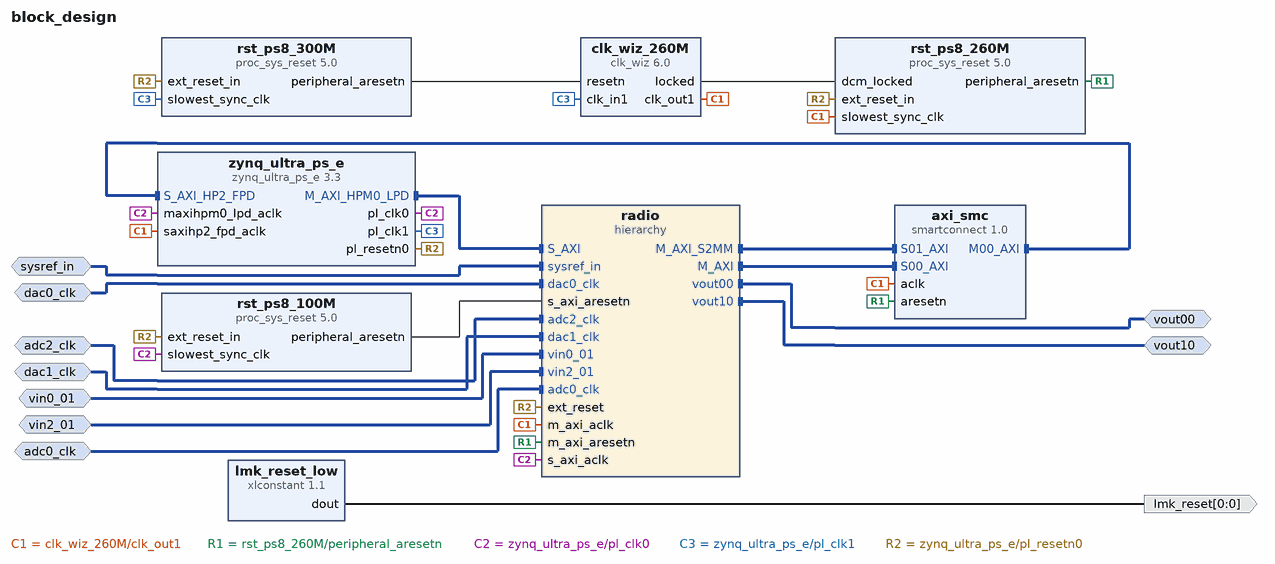
[diagram p0: block diagram of the top level]
# Vivado block design block_design, xczu28dr-ffvg1517-2-e, Vivado 2020.1
create_bd_design block_design

create_bd_intf_port -mode Slave -vlnv xilinx.com:interface:diff_clock_rtl:1.0 adc0_clk
set_property -dict {CONFIG.FREQ_HZ 409600000.0} [get_bd_intf_ports adc0_clk]
create_bd_intf_port -mode Slave -vlnv xilinx.com:interface:diff_clock_rtl:1.0 adc2_clk
set_property -dict {CONFIG.FREQ_HZ 409600000.0} [get_bd_intf_ports adc2_clk]
create_bd_intf_port -mode Slave -vlnv xilinx.com:interface:diff_clock_rtl:1.0 dac0_clk
set_property -dict {CONFIG.FREQ_HZ 256000000.0} [get_bd_intf_ports dac0_clk]
create_bd_intf_port -mode Slave -vlnv xilinx.com:interface:diff_clock_rtl:1.0 dac1_clk
set_property -dict {CONFIG.FREQ_HZ 409600000.0} [get_bd_intf_ports dac1_clk]
create_bd_intf_port -mode Slave -vlnv xilinx.com:display_usp_rf_data_converter:diff_pins_rtl:1.0 sysref_in
create_bd_intf_port -mode Slave -vlnv xilinx.com:interface:diff_analog_io_rtl:1.0 vin0_01
create_bd_intf_port -mode Slave -vlnv xilinx.com:interface:diff_analog_io_rtl:1.0 vin2_01
create_bd_intf_port -mode Master -vlnv xilinx.com:interface:diff_analog_io_rtl:1.0 vout00
create_bd_intf_port -mode Master -vlnv xilinx.com:interface:diff_analog_io_rtl:1.0 vout10
create_bd_port -dir O -from 0 -to 0 lmk_reset

create_bd_cell -type ip -vlnv xilinx.com:ip:smartconnect:1.0 axi_smc
set_property -dict {CONFIG.NUM_SI 2} [get_bd_cells axi_smc]
create_bd_cell -type ip -vlnv xilinx.com:ip:clk_wiz:6.0 clk_wiz_260M
set_property -dict [list \
  CONFIG.CLKOUT1_JITTER 173.009 \
  CONFIG.CLKOUT1_PHASE_ERROR 308.262 \
  CONFIG.CLKOUT1_REQUESTED_OUT_FREQ 259.99740 \
  CONFIG.MMCM_CLKFBOUT_MULT_F 60.125 \
  CONFIG.MMCM_CLKOUT0_DIVIDE_F 4.625 \
  CONFIG.MMCM_DIVCLK_DIVIDE 15 \
  CONFIG.RESET_PORT resetn \
  CONFIG.RESET_TYPE ACTIVE_LOW \
] [get_bd_cells clk_wiz_260M]
create_bd_cell -type ip -vlnv xilinx.com:ip:xlconstant:1.1 lmk_reset_low
set_property -dict {CONFIG.CONST_VAL 0} [get_bd_cells lmk_reset_low]
create_bd_cell -type hier radio
create_bd_cell -type ip -vlnv xilinx.com:ip:proc_sys_reset:5.0 rst_ps8_100M
create_bd_cell -type ip -vlnv xilinx.com:ip:proc_sys_reset:5.0 rst_ps8_260M
create_bd_cell -type ip -vlnv xilinx.com:ip:proc_sys_reset:5.0 rst_ps8_300M
create_bd_cell -type ip -vlnv xilinx.com:ip:zynq_ultra_ps_e:3.3 zynq_ultra_ps_e
set_property -dict [list \
  CONFIG.PSU__CRL_APB__PL0_REF_CTRL__SRCSEL IOPLL \
  CONFIG.PSU__CRL_APB__PL1_REF_CTRL__FREQMHZ 300 \
  CONFIG.PSU__CRL_APB__PL1_REF_CTRL__SRCSEL IOPLL \
  CONFIG.PSU__DDR_HIGH_ADDRESS_GUI_ENABLE 0 \
  CONFIG.PSU__FPGA_PL1_ENABLE 1 \
  CONFIG.PSU__USE__S_AXI_GP4 1 \
] [get_bd_cells zynq_ultra_ps_e]
# 28 more settings of zynq_ultra_ps_e are not shown: defaults, MIO pin electricals, DDR timing, and values the tool derives

# ---- hierarchy /radio ----
current_bd_instance /radio
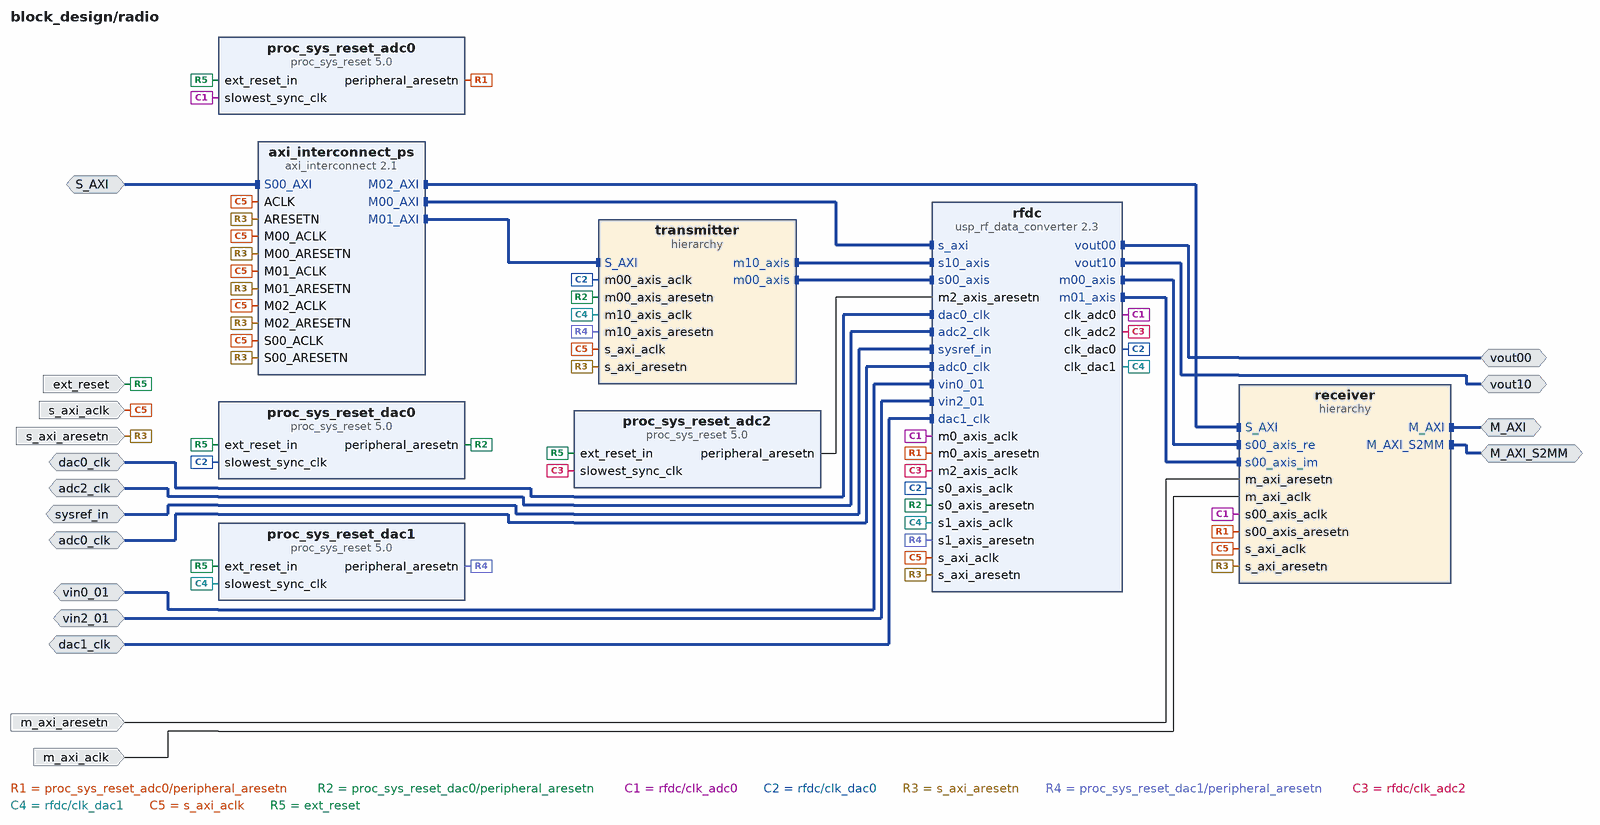
[diagram p1: block diagram inside /radio]
create_bd_intf_pin -mode Master -vlnv xilinx.com:interface:aximm_rtl:1.0 M_AXI
create_bd_intf_pin -mode Slave -vlnv xilinx.com:interface:aximm_rtl:1.0 S_AXI
create_bd_intf_pin -mode Slave -vlnv xilinx.com:interface:diff_clock_rtl:1.0 adc0_clk
create_bd_intf_pin -mode Slave -vlnv xilinx.com:interface:diff_clock_rtl:1.0 adc2_clk
create_bd_intf_pin -mode Slave -vlnv xilinx.com:interface:diff_clock_rtl:1.0 dac0_clk
create_bd_intf_pin -mode Slave -vlnv xilinx.com:interface:diff_clock_rtl:1.0 dac1_clk
create_bd_intf_pin -mode Slave -vlnv xilinx.com:display_usp_rf_data_converter:diff_pins_rtl:1.0 sysref_in
create_bd_intf_pin -mode Slave -vlnv xilinx.com:interface:diff_analog_io_rtl:1.0 vin0_01
create_bd_intf_pin -mode Slave -vlnv xilinx.com:interface:diff_analog_io_rtl:1.0 vin2_01
create_bd_intf_pin -mode Master -vlnv xilinx.com:interface:diff_analog_io_rtl:1.0 vout00
create_bd_intf_pin -mode Master -vlnv xilinx.com:interface:diff_analog_io_rtl:1.0 vout10
create_bd_intf_pin -mode Master -vlnv xilinx.com:interface:aximm_rtl:1.0 M_AXI_S2MM
create_bd_pin -dir I -type rst ext_reset
create_bd_pin -dir I -type clk m_axi_aclk
create_bd_pin -dir I -type rst m_axi_aresetn
create_bd_pin -dir I -type clk s_axi_aclk
create_bd_pin -dir I -type rst s_axi_aresetn

create_bd_cell -type ip -vlnv xilinx.com:ip:axi_interconnect:2.1 axi_interconnect_ps
set_property -dict {CONFIG.NUM_MI 3} [get_bd_cells axi_interconnect_ps]
create_bd_cell -type ip -vlnv xilinx.com:ip:proc_sys_reset:5.0 proc_sys_reset_adc0
create_bd_cell -type ip -vlnv xilinx.com:ip:proc_sys_reset:5.0 proc_sys_reset_adc2
create_bd_cell -type ip -vlnv xilinx.com:ip:proc_sys_reset:5.0 proc_sys_reset_dac0
create_bd_cell -type ip -vlnv xilinx.com:ip:proc_sys_reset:5.0 proc_sys_reset_dac1
create_bd_cell -type hier receiver
create_bd_cell -type ip -vlnv xilinx.com:ip:usp_rf_data_converter:2.3 rfdc
set_property -dict [list \
  CONFIG.ADC0_Outclk_Freq 153.600 \
  CONFIG.ADC0_PLL_Enable true \
  CONFIG.ADC0_Refclk_Freq 409.600 \
  CONFIG.ADC0_Sampling_Rate 2.4576 \
  CONFIG.ADC2_Outclk_Freq 256.000 \
  CONFIG.ADC2_PLL_Enable true \
  CONFIG.ADC2_Refclk_Freq 409.600 \
  CONFIG.ADC2_Sampling_Rate 4.096 \
  CONFIG.ADC_Data_Type00 1 \
  CONFIG.ADC_Data_Type20 1 \
  CONFIG.ADC_Data_Width00 8 \
  CONFIG.ADC_Decimation_Mode00 2 \
  CONFIG.ADC_Decimation_Mode20 2 \
  CONFIG.ADC_Mixer_Mode00 0 \
  CONFIG.ADC_Mixer_Mode20 0 \
  CONFIG.ADC_Mixer_Type00 2 \
  CONFIG.ADC_Mixer_Type01 2 \
  CONFIG.ADC_Mixer_Type20 2 \
  CONFIG.ADC_Mixer_Type21 2 \
  CONFIG.ADC_Slice00_Enable true \
  CONFIG.ADC_Slice20_Enable true \
  CONFIG.DAC0_Outclk_Freq 256.000 \
  CONFIG.DAC0_PLL_Enable true \
  CONFIG.DAC0_Refclk_Freq 256.000 \
  CONFIG.DAC0_Sampling_Rate 4.096 \
  CONFIG.DAC1_Outclk_Freq 256.000 \
  CONFIG.DAC1_PLL_Enable true \
  CONFIG.DAC1_Refclk_Freq 409.600 \
  CONFIG.DAC1_Sampling_Rate 4.096 \
  CONFIG.DAC_Data_Type10 0 \
  CONFIG.DAC_Data_Width10 16 \
  CONFIG.DAC_Interpolation_Mode00 2 \
  CONFIG.DAC_Interpolation_Mode10 2 \
  CONFIG.DAC_Mixer_Mode00 0 \
  CONFIG.DAC_Mixer_Mode10 0 \
  CONFIG.DAC_Mixer_Type00 2 \
  CONFIG.DAC_Mixer_Type10 2 \
  CONFIG.DAC_Slice00_Enable true \
  CONFIG.DAC_Slice10_Enable true \
] [get_bd_cells rfdc]
create_bd_cell -type hier transmitter

# ---- hierarchy /radio/receiver ----
current_bd_instance /radio/receiver
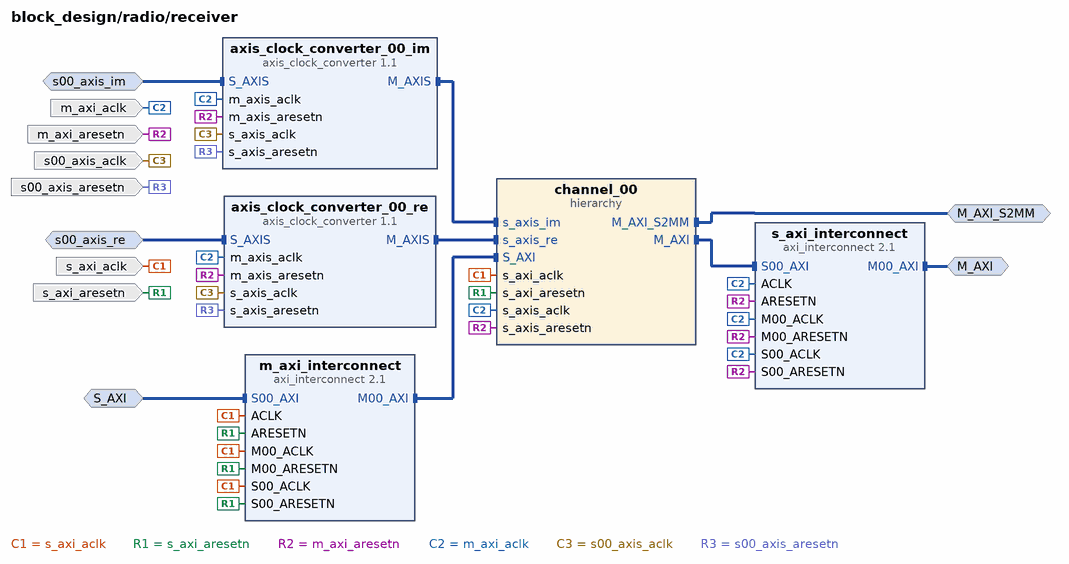
[diagram p2: block diagram inside /radio/receiver]
create_bd_intf_pin -mode Master -vlnv xilinx.com:interface:aximm_rtl:1.0 M_AXI
create_bd_intf_pin -mode Slave -vlnv xilinx.com:interface:aximm_rtl:1.0 S_AXI
create_bd_intf_pin -mode Slave -vlnv xilinx.com:interface:axis_rtl:1.0 s00_axis_im
create_bd_intf_pin -mode Slave -vlnv xilinx.com:interface:axis_rtl:1.0 s00_axis_re
create_bd_intf_pin -mode Master -vlnv xilinx.com:interface:aximm_rtl:1.0 M_AXI_S2MM
create_bd_pin -dir I -type clk m_axi_aclk
create_bd_pin -dir I -type rst m_axi_aresetn
create_bd_pin -dir I -type clk s00_axis_aclk
create_bd_pin -dir I -type rst s00_axis_aresetn
create_bd_pin -dir I -type clk s_axi_aclk
create_bd_pin -dir I -type rst s_axi_aresetn

create_bd_cell -type ip -vlnv xilinx.com:ip:axis_clock_converter:1.1 axis_clock_converter_00_im
set_property -dict {CONFIG.SYNCHRONIZATION_STAGES 5} [get_bd_cells axis_clock_converter_00_im]
create_bd_cell -type ip -vlnv xilinx.com:ip:axis_clock_converter:1.1 axis_clock_converter_00_re
set_property -dict {CONFIG.SYNCHRONIZATION_STAGES 5} [get_bd_cells axis_clock_converter_00_re]
create_bd_cell -type hier channel_00
create_bd_cell -type ip -vlnv xilinx.com:ip:axi_interconnect:2.1 m_axi_interconnect
set_property -dict {CONFIG.NUM_MI 1} [get_bd_cells m_axi_interconnect]
create_bd_cell -type ip -vlnv xilinx.com:ip:axi_interconnect:2.1 s_axi_interconnect
set_property -dict [list \
  CONFIG.M00_HAS_DATA_FIFO 2 \
  CONFIG.NUM_MI 1 \
  CONFIG.NUM_SI 1 \
  CONFIG.S00_HAS_DATA_FIFO 2 \
  CONFIG.S01_HAS_DATA_FIFO 2 \
  CONFIG.STRATEGY 0 \
] [get_bd_cells s_axi_interconnect]

# ---- hierarchy /radio/receiver/channel_00 ----
current_bd_instance /radio/receiver/channel_00
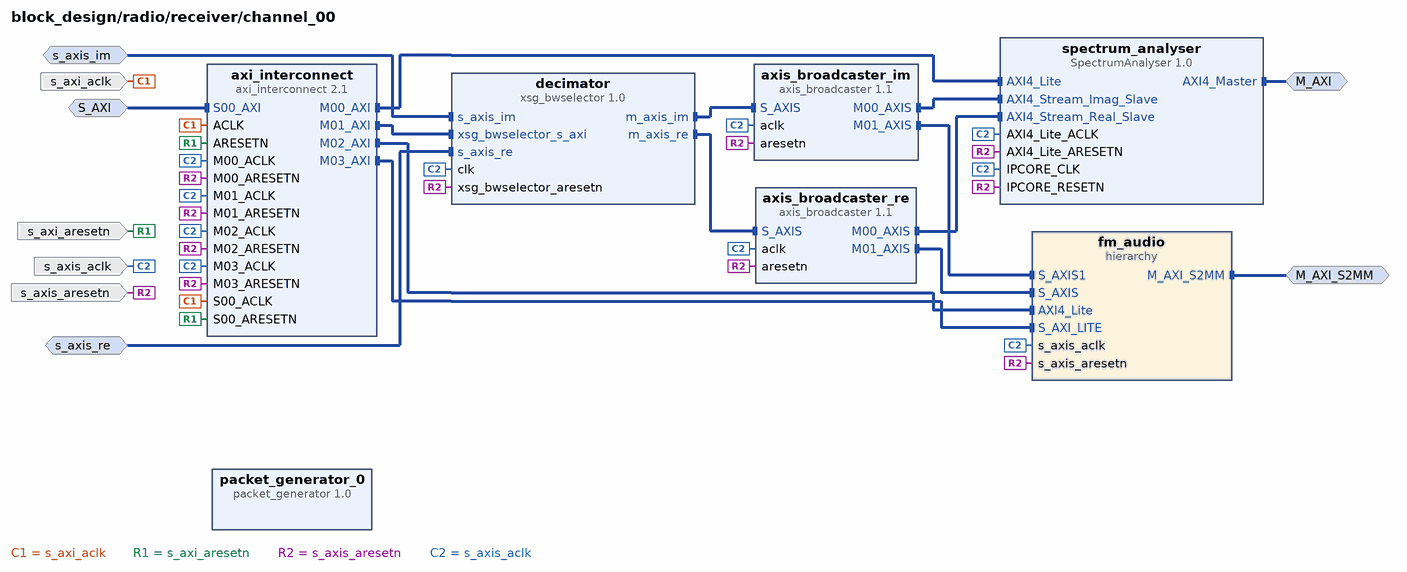
[diagram p3: block diagram inside /radio/receiver/channel_00]
create_bd_intf_pin -mode Master -vlnv xilinx.com:interface:aximm_rtl:1.0 M_AXI
create_bd_intf_pin -mode Slave -vlnv xilinx.com:interface:aximm_rtl:1.0 S_AXI
create_bd_intf_pin -mode Slave -vlnv xilinx.com:interface:axis_rtl:1.0 s_axis_im
create_bd_intf_pin -mode Slave -vlnv xilinx.com:interface:axis_rtl:1.0 s_axis_re
create_bd_intf_pin -mode Master -vlnv xilinx.com:interface:aximm_rtl:1.0 M_AXI_S2MM
create_bd_pin -dir I -type clk s_axi_aclk
create_bd_pin -dir I -type rst s_axi_aresetn
create_bd_pin -dir I -type clk s_axis_aclk
create_bd_pin -dir I -type rst s_axis_aresetn

create_bd_cell -type ip -vlnv xilinx.com:ip:axi_interconnect:2.1 axi_interconnect
set_property -dict {CONFIG.NUM_MI 4} [get_bd_cells axi_interconnect]
create_bd_cell -type ip -vlnv User_Company:RFSoC:xsg_bwselector:1.0 decimator
create_bd_cell -type ip -vlnv xilinx.com:ip:SpectrumAnalyser:1.0 spectrum_analyser
create_bd_cell -type ip -vlnv xilinx.com:ip:axis_broadcaster:1.1 axis_broadcaster_im
create_bd_cell -type ip -vlnv xilinx.com:ip:axis_broadcaster:1.1 axis_broadcaster_re
create_bd_cell -type hier fm_audio
create_bd_cell -type ip -vlnv xilinx.com:ip:packet_generator:1.0 packet_generator_0

# ---- hierarchy /radio/receiver/channel_00/fm_audio ----
current_bd_instance /radio/receiver/channel_00/fm_audio
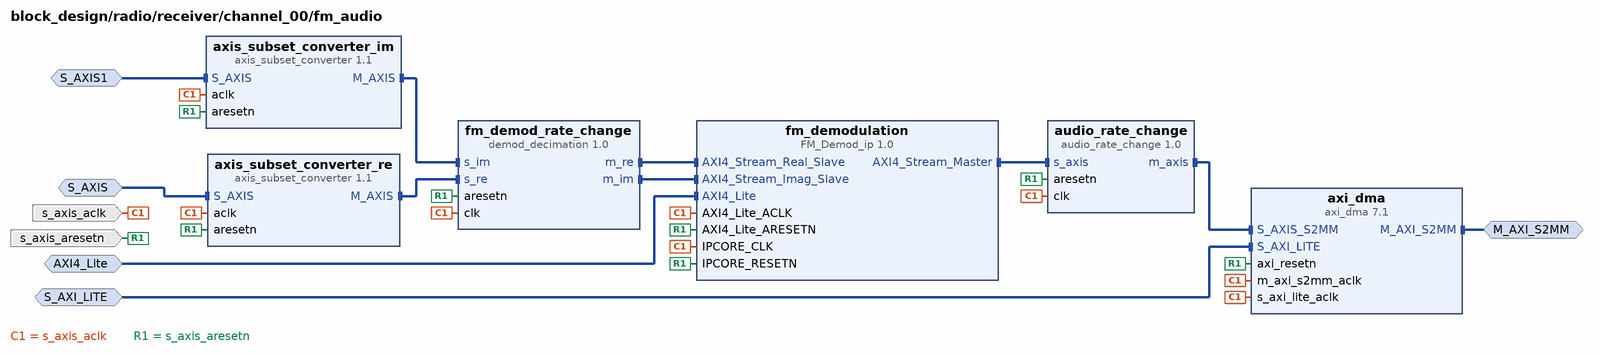
[diagram p4: block diagram inside /radio/receiver/channel_00/fm_audio]
create_bd_intf_pin -mode Slave -vlnv xilinx.com:interface:axis_rtl:1.0 S_AXIS
create_bd_intf_pin -mode Slave -vlnv xilinx.com:interface:axis_rtl:1.0 S_AXIS1
create_bd_intf_pin -mode Slave -vlnv xilinx.com:interface:aximm_rtl:1.0 AXI4_Lite
create_bd_intf_pin -mode Slave -vlnv xilinx.com:interface:aximm_rtl:1.0 S_AXI_LITE
create_bd_intf_pin -mode Master -vlnv xilinx.com:interface:aximm_rtl:1.0 M_AXI_S2MM
create_bd_pin -dir I -type clk s_axis_aclk
create_bd_pin -dir I -type rst s_axis_aresetn

create_bd_cell -type ip -vlnv xilinx.com:ip:axis_subset_converter:1.1 axis_subset_converter_re
set_property -dict [list \
  CONFIG.M_TDATA_NUM_BYTES 2 \
  CONFIG.S_TDATA_NUM_BYTES 16 \
  CONFIG.TDATA_REMAP {tdata[15:0]} \
] [get_bd_cells axis_subset_converter_re]
create_bd_cell -type ip -vlnv User_Company:SysGen:demod_decimation:1.0 fm_demod_rate_change
create_bd_cell -type ip -vlnv xilinx.com:ip:axis_subset_converter:1.1 axis_subset_converter_im
set_property -dict [list \
  CONFIG.M_TDATA_NUM_BYTES 2 \
  CONFIG.S_TDATA_NUM_BYTES 16 \
  CONFIG.TDATA_REMAP {tdata[15:0]} \
] [get_bd_cells axis_subset_converter_im]
create_bd_cell -type ip -vlnv User_Company:SysGen:audio_rate_change:1.0 audio_rate_change
create_bd_cell -type ip -vlnv ac.uk:ip:FM_Demod_ip:1.0 fm_demodulation
create_bd_cell -type ip -vlnv xilinx.com:ip:axi_dma:7.1 axi_dma
set_property -dict [list \
  CONFIG.c_addr_width 64 \
  CONFIG.c_include_mm2s 0 \
  CONFIG.c_include_sg 0 \
  CONFIG.c_s2mm_burst_size 256 \
] [get_bd_cells axi_dma]

# ---- hierarchy /radio/transmitter ----
current_bd_instance /radio/transmitter
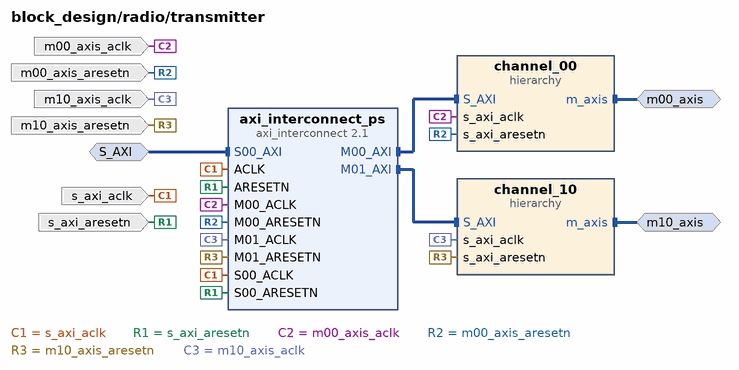
[diagram p5: block diagram inside /radio/transmitter]
create_bd_intf_pin -mode Slave -vlnv xilinx.com:interface:aximm_rtl:1.0 S_AXI
create_bd_intf_pin -mode Master -vlnv xilinx.com:interface:axis_rtl:1.0 m00_axis
create_bd_intf_pin -mode Master -vlnv xilinx.com:interface:axis_rtl:1.0 m10_axis
create_bd_pin -dir I -type clk m00_axis_aclk
create_bd_pin -dir I -type rst m00_axis_aresetn
create_bd_pin -dir I -type clk m10_axis_aclk
create_bd_pin -dir I -type rst m10_axis_aresetn
create_bd_pin -dir I -type clk s_axi_aclk
create_bd_pin -dir I -type rst s_axi_aresetn

create_bd_cell -type ip -vlnv xilinx.com:ip:axi_interconnect:2.1 axi_interconnect_ps
create_bd_cell -type hier channel_00
create_bd_cell -type hier channel_10

# ---- hierarchy /radio/transmitter/channel_00 ----
current_bd_instance /radio/transmitter/channel_00
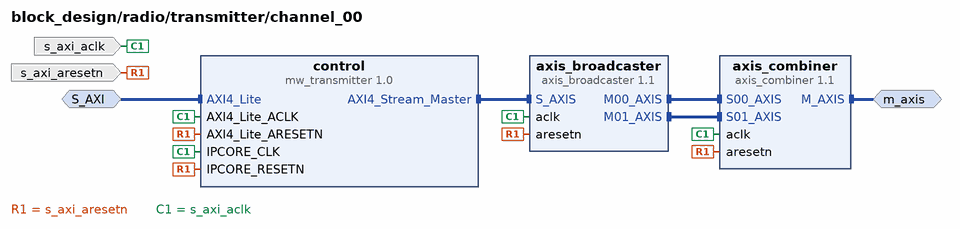
[diagram p6: block diagram inside /radio/transmitter/channel_00]
create_bd_intf_pin -mode Slave -vlnv xilinx.com:interface:aximm_rtl:1.0 S_AXI
create_bd_intf_pin -mode Master -vlnv xilinx.com:interface:axis_rtl:1.0 m_axis
create_bd_pin -dir I -type clk s_axi_aclk
create_bd_pin -dir I -type rst s_axi_aresetn

create_bd_cell -type ip -vlnv xilinx.com:ip:axis_broadcaster:1.1 axis_broadcaster
create_bd_cell -type ip -vlnv xilinx.com:ip:axis_combiner:1.1 axis_combiner
create_bd_cell -type ip -vlnv xilinx.com:ip:mw_transmitter:1.0 control

# ---- hierarchy /radio/transmitter/channel_10 ----
current_bd_instance /radio/transmitter/channel_10
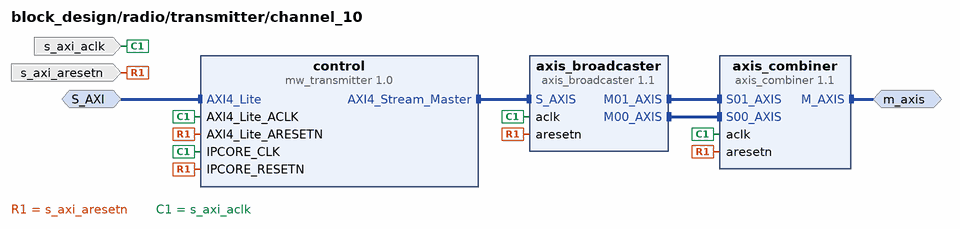
[diagram p7: block diagram inside /radio/transmitter/channel_10]
create_bd_intf_pin -mode Slave -vlnv xilinx.com:interface:aximm_rtl:1.0 S_AXI
create_bd_intf_pin -mode Master -vlnv xilinx.com:interface:axis_rtl:1.0 m_axis
create_bd_pin -dir I -type clk s_axi_aclk
create_bd_pin -dir I -type rst s_axi_aresetn

create_bd_cell -type ip -vlnv xilinx.com:ip:axis_broadcaster:1.1 axis_broadcaster
create_bd_cell -type ip -vlnv xilinx.com:ip:axis_combiner:1.1 axis_combiner
create_bd_cell -type ip -vlnv xilinx.com:ip:mw_transmitter:1.0 control

# ---- connections ----

current_bd_instance /radio
connect_bd_intf_net [get_bd_intf_pins M_AXI] [get_bd_intf_pins receiver/M_AXI]
connect_bd_intf_net [get_bd_intf_pins receiver/s00_axis_re] [get_bd_intf_pins rfdc/m00_axis]
connect_bd_intf_net [get_bd_intf_pins rfdc/s10_axis] [get_bd_intf_pins transmitter/m10_axis]
connect_bd_intf_net [get_bd_intf_pins vout10] [get_bd_intf_pins rfdc/vout10]
connect_bd_intf_net [get_bd_intf_pins receiver/s00_axis_im] [get_bd_intf_pins rfdc/m01_axis]
connect_bd_intf_net [get_bd_intf_pins dac0_clk] [get_bd_intf_pins rfdc/dac0_clk]
connect_bd_intf_net [get_bd_intf_pins adc2_clk] [get_bd_intf_pins rfdc/adc2_clk]
connect_bd_intf_net [get_bd_intf_pins S_AXI] [get_bd_intf_pins axi_interconnect_ps/S00_AXI]
connect_bd_intf_net [get_bd_intf_pins vout00] [get_bd_intf_pins rfdc/vout00]
connect_bd_intf_net [get_bd_intf_pins axi_interconnect_ps/M02_AXI] [get_bd_intf_pins receiver/S_AXI]
connect_bd_intf_net [get_bd_intf_pins axi_interconnect_ps/M01_AXI] [get_bd_intf_pins transmitter/S_AXI]
connect_bd_intf_net [get_bd_intf_pins sysref_in] [get_bd_intf_pins rfdc/sysref_in]
connect_bd_intf_net [get_bd_intf_pins rfdc/s00_axis] [get_bd_intf_pins transmitter/m00_axis]
connect_bd_intf_net [get_bd_intf_pins adc0_clk] [get_bd_intf_pins rfdc/adc0_clk]
connect_bd_intf_net [get_bd_intf_pins M_AXI_S2MM] [get_bd_intf_pins receiver/M_AXI_S2MM]
connect_bd_intf_net [get_bd_intf_pins vin0_01] [get_bd_intf_pins rfdc/vin0_01]
connect_bd_intf_net [get_bd_intf_pins axi_interconnect_ps/M00_AXI] [get_bd_intf_pins rfdc/s_axi]
connect_bd_intf_net [get_bd_intf_pins vin2_01] [get_bd_intf_pins rfdc/vin2_01]
connect_bd_intf_net [get_bd_intf_pins dac1_clk] [get_bd_intf_pins rfdc/dac1_clk]
connect_bd_net -net IPCORE_RESETN_0_1 [get_bd_pins m_axi_aresetn] [get_bd_pins receiver/m_axi_aresetn]
connect_bd_net -net m_axis_aclk_0_1 [get_bd_pins m_axi_aclk] [get_bd_pins receiver/m_axi_aclk]
connect_bd_net -net proc_sys_reset_adc3_peripheral_aresetn [get_bd_pins proc_sys_reset_adc0/peripheral_aresetn] \
  [get_bd_pins receiver/s00_axis_aresetn] [get_bd_pins rfdc/m0_axis_aresetn]
connect_bd_net [get_bd_pins proc_sys_reset_dac0/peripheral_aresetn] [get_bd_pins rfdc/s0_axis_aresetn] [get_bd_pins transmitter/m00_axis_aresetn]
connect_bd_net -net proc_sys_reset_peripheral_aresetn [get_bd_pins proc_sys_reset_adc2/peripheral_aresetn] [get_bd_pins rfdc/m2_axis_aresetn]
connect_bd_net [get_bd_pins rfdc/clk_adc0] \
  [get_bd_pins proc_sys_reset_adc0/slowest_sync_clk] [get_bd_pins receiver/s00_axis_aclk] [get_bd_pins rfdc/m0_axis_aclk]
connect_bd_net [get_bd_pins rfdc/clk_dac0] \
  [get_bd_pins proc_sys_reset_dac0/slowest_sync_clk] [get_bd_pins rfdc/s0_axis_aclk] [get_bd_pins transmitter/m00_axis_aclk]
connect_bd_net -net rst_ps8_96M_peripheral_aresetn [get_bd_pins s_axi_aresetn] \
  [get_bd_pins axi_interconnect_ps/ARESETN] [get_bd_pins axi_interconnect_ps/M00_ARESETN] \
  [get_bd_pins axi_interconnect_ps/M01_ARESETN] [get_bd_pins axi_interconnect_ps/M02_ARESETN] \
  [get_bd_pins axi_interconnect_ps/S00_ARESETN] [get_bd_pins receiver/s_axi_aresetn] [get_bd_pins rfdc/s_axi_aresetn] \
  [get_bd_pins transmitter/s_axi_aresetn]
connect_bd_net -net rst_usp_rf_data_converter_256M_peripheral_aresetn [get_bd_pins proc_sys_reset_dac1/peripheral_aresetn] \
  [get_bd_pins rfdc/s1_axis_aresetn] [get_bd_pins transmitter/m10_axis_aresetn]
connect_bd_net -net usp_rf_data_converter_clk_adc2 [get_bd_pins rfdc/clk_adc2] \
  [get_bd_pins proc_sys_reset_adc2/slowest_sync_clk] [get_bd_pins rfdc/m2_axis_aclk]
connect_bd_net -net usp_rf_data_converter_clk_dac1 [get_bd_pins rfdc/clk_dac1] \
  [get_bd_pins proc_sys_reset_dac1/slowest_sync_clk] [get_bd_pins rfdc/s1_axis_aclk] [get_bd_pins transmitter/m10_axis_aclk]
connect_bd_net -net zynq_ultra_ps_e_pl_clk0 [get_bd_pins s_axi_aclk] \
  [get_bd_pins axi_interconnect_ps/ACLK] [get_bd_pins axi_interconnect_ps/M00_ACLK] \
  [get_bd_pins axi_interconnect_ps/M01_ACLK] [get_bd_pins axi_interconnect_ps/M02_ACLK] \
  [get_bd_pins axi_interconnect_ps/S00_ACLK] [get_bd_pins receiver/s_axi_aclk] [get_bd_pins rfdc/s_axi_aclk] \
  [get_bd_pins transmitter/s_axi_aclk]
connect_bd_net -net zynq_ultra_ps_e_pl_resetn0 [get_bd_pins ext_reset] \
  [get_bd_pins proc_sys_reset_adc0/ext_reset_in] [get_bd_pins proc_sys_reset_adc2/ext_reset_in] \
  [get_bd_pins proc_sys_reset_dac0/ext_reset_in] [get_bd_pins proc_sys_reset_dac1/ext_reset_in]

current_bd_instance /radio/receiver
connect_bd_intf_net [get_bd_intf_pins channel_00/S_AXI] [get_bd_intf_pins m_axi_interconnect/M00_AXI]
connect_bd_intf_net [get_bd_intf_pins s00_axis_re] [get_bd_intf_pins axis_clock_converter_00_re/S_AXIS]
connect_bd_intf_net [get_bd_intf_pins axis_clock_converter_00_im/M_AXIS] [get_bd_intf_pins channel_00/s_axis_im]
connect_bd_intf_net [get_bd_intf_pins M_AXI] [get_bd_intf_pins s_axi_interconnect/M00_AXI]
connect_bd_intf_net [get_bd_intf_pins S_AXI] [get_bd_intf_pins m_axi_interconnect/S00_AXI]
connect_bd_intf_net [get_bd_intf_pins channel_00/M_AXI] [get_bd_intf_pins s_axi_interconnect/S00_AXI]
connect_bd_intf_net [get_bd_intf_pins s00_axis_im] [get_bd_intf_pins axis_clock_converter_00_im/S_AXIS]
connect_bd_intf_net [get_bd_intf_pins axis_clock_converter_00_re/M_AXIS] [get_bd_intf_pins channel_00/s_axis_re]
connect_bd_intf_net [get_bd_intf_pins M_AXI_S2MM] [get_bd_intf_pins channel_00/M_AXI_S2MM]
connect_bd_net -net ACLK_1 [get_bd_pins s_axi_aclk] \
  [get_bd_pins channel_00/s_axi_aclk] [get_bd_pins m_axi_interconnect/ACLK] [get_bd_pins m_axi_interconnect/M00_ACLK] \
  [get_bd_pins m_axi_interconnect/S00_ACLK]
connect_bd_net -net ARESETN_1 [get_bd_pins s_axi_aresetn] \
  [get_bd_pins channel_00/s_axi_aresetn] [get_bd_pins m_axi_interconnect/ARESETN] \
  [get_bd_pins m_axi_interconnect/M00_ARESETN] [get_bd_pins m_axi_interconnect/S00_ARESETN]
connect_bd_net -net IPCORE_RESETN_0_1 [get_bd_pins m_axi_aresetn] \
  [get_bd_pins axis_clock_converter_00_im/m_axis_aresetn] [get_bd_pins axis_clock_converter_00_re/m_axis_aresetn] \
  [get_bd_pins channel_00/s_axis_aresetn] [get_bd_pins s_axi_interconnect/ARESETN] \
  [get_bd_pins s_axi_interconnect/M00_ARESETN] [get_bd_pins s_axi_interconnect/S00_ARESETN]
connect_bd_net -net m_axis_aclk_0_1 [get_bd_pins m_axi_aclk] \
  [get_bd_pins axis_clock_converter_00_im/m_axis_aclk] [get_bd_pins axis_clock_converter_00_re/m_axis_aclk] \
  [get_bd_pins channel_00/s_axis_aclk] [get_bd_pins s_axi_interconnect/ACLK] [get_bd_pins s_axi_interconnect/M00_ACLK] \
  [get_bd_pins s_axi_interconnect/S00_ACLK]
connect_bd_net -net s_axis_aclk_1 [get_bd_pins s00_axis_aclk] \
  [get_bd_pins axis_clock_converter_00_im/s_axis_aclk] [get_bd_pins axis_clock_converter_00_re/s_axis_aclk]
connect_bd_net -net s_axis_aresetn_1 [get_bd_pins s00_axis_aresetn] \
  [get_bd_pins axis_clock_converter_00_im/s_axis_aresetn] [get_bd_pins axis_clock_converter_00_re/s_axis_aresetn]

current_bd_instance /radio/receiver/channel_00
connect_bd_intf_net [get_bd_intf_pins S_AXI] [get_bd_intf_pins axi_interconnect/S00_AXI]
connect_bd_intf_net [get_bd_intf_pins axis_broadcaster_im/S_AXIS] [get_bd_intf_pins decimator/m_axis_im]
connect_bd_intf_net [get_bd_intf_pins axis_broadcaster_im/M01_AXIS] [get_bd_intf_pins fm_audio/S_AXIS1]
connect_bd_intf_net [get_bd_intf_pins axi_interconnect/M01_AXI] [get_bd_intf_pins decimator/xsg_bwselector_s_axi]
connect_bd_intf_net [get_bd_intf_pins s_axis_im] [get_bd_intf_pins decimator/s_axis_im]
connect_bd_intf_net [get_bd_intf_pins s_axis_re] [get_bd_intf_pins decimator/s_axis_re]
connect_bd_intf_net [get_bd_intf_pins axis_broadcaster_re/M00_AXIS] [get_bd_intf_pins spectrum_analyser/AXI4_Stream_Real_Slave]
connect_bd_intf_net [get_bd_intf_pins fm_audio/AXI4_Lite] [get_bd_intf_pins axi_interconnect/M02_AXI]
connect_bd_intf_net [get_bd_intf_pins axi_interconnect/M03_AXI] [get_bd_intf_pins fm_audio/S_AXI_LITE]
connect_bd_intf_net [get_bd_intf_pins axis_broadcaster_im/M00_AXIS] [get_bd_intf_pins spectrum_analyser/AXI4_Stream_Imag_Slave]
connect_bd_intf_net [get_bd_intf_pins M_AXI] [get_bd_intf_pins spectrum_analyser/AXI4_Master]
connect_bd_intf_net [get_bd_intf_pins axi_interconnect/M00_AXI] [get_bd_intf_pins spectrum_analyser/AXI4_Lite]
connect_bd_intf_net [get_bd_intf_pins axis_broadcaster_re/M01_AXIS] [get_bd_intf_pins fm_audio/S_AXIS]
connect_bd_intf_net [get_bd_intf_pins M_AXI_S2MM] [get_bd_intf_pins fm_audio/M_AXI_S2MM]
connect_bd_intf_net [get_bd_intf_pins axis_broadcaster_re/S_AXIS] [get_bd_intf_pins decimator/m_axis_re]
connect_bd_net -net ACLK_1 [get_bd_pins s_axi_aclk] [get_bd_pins axi_interconnect/ACLK] [get_bd_pins axi_interconnect/S00_ACLK]
connect_bd_net -net ARESETN_1 [get_bd_pins s_axi_aresetn] [get_bd_pins axi_interconnect/ARESETN] [get_bd_pins axi_interconnect/S00_ARESETN]
connect_bd_net -net proc_sys_reset_peripheral_aresetn [get_bd_pins s_axis_aresetn] \
  [get_bd_pins axi_interconnect/M00_ARESETN] [get_bd_pins axi_interconnect/M01_ARESETN] \
  [get_bd_pins decimator/xsg_bwselector_aresetn] [get_bd_pins spectrum_analyser/AXI4_Lite_ARESETN] \
  [get_bd_pins spectrum_analyser/IPCORE_RESETN] [get_bd_pins axis_broadcaster_re/aresetn] \
  [get_bd_pins axis_broadcaster_im/aresetn] [get_bd_pins axi_interconnect/M02_ARESETN] \
  [get_bd_pins axi_interconnect/M03_ARESETN] [get_bd_pins fm_audio/s_axis_aresetn]
connect_bd_net -net usp_rf_data_converter_clk_adc2 [get_bd_pins s_axis_aclk] \
  [get_bd_pins axi_interconnect/M00_ACLK] [get_bd_pins axi_interconnect/M01_ACLK] [get_bd_pins decimator/clk] \
  [get_bd_pins spectrum_analyser/AXI4_Lite_ACLK] [get_bd_pins spectrum_analyser/IPCORE_CLK] \
  [get_bd_pins axis_broadcaster_re/aclk] [get_bd_pins axis_broadcaster_im/aclk] [get_bd_pins axi_interconnect/M02_ACLK] \
  [get_bd_pins axi_interconnect/M03_ACLK] [get_bd_pins fm_audio/s_axis_aclk]

current_bd_instance /radio/receiver/channel_00/fm_audio
connect_bd_intf_net [get_bd_intf_pins fm_demod_rate_change/m_re] [get_bd_intf_pins fm_demodulation/AXI4_Stream_Real_Slave]
connect_bd_intf_net [get_bd_intf_pins S_AXIS1] [get_bd_intf_pins axis_subset_converter_im/S_AXIS]
connect_bd_intf_net [get_bd_intf_pins fm_demodulation/AXI4_Stream_Master] [get_bd_intf_pins audio_rate_change/s_axis]
connect_bd_intf_net [get_bd_intf_pins axis_subset_converter_re/M_AXIS] [get_bd_intf_pins fm_demod_rate_change/s_re]
connect_bd_intf_net [get_bd_intf_pins S_AXIS] [get_bd_intf_pins axis_subset_converter_re/S_AXIS]
connect_bd_intf_net [get_bd_intf_pins axis_subset_converter_im/M_AXIS] [get_bd_intf_pins fm_demod_rate_change/s_im]
connect_bd_intf_net [get_bd_intf_pins audio_rate_change/m_axis] [get_bd_intf_pins axi_dma/S_AXIS_S2MM]
connect_bd_intf_net [get_bd_intf_pins fm_demod_rate_change/m_im] [get_bd_intf_pins fm_demodulation/AXI4_Stream_Imag_Slave]
connect_bd_intf_net [get_bd_intf_pins S_AXI_LITE] [get_bd_intf_pins axi_dma/S_AXI_LITE]
connect_bd_intf_net [get_bd_intf_pins AXI4_Lite] [get_bd_intf_pins fm_demodulation/AXI4_Lite]
connect_bd_intf_net [get_bd_intf_pins M_AXI_S2MM] [get_bd_intf_pins axi_dma/M_AXI_S2MM]
connect_bd_net -net usp_rf_data_converter_clk_adc2 [get_bd_pins s_axis_aclk] \
  [get_bd_pins axi_dma/s_axi_lite_aclk] [get_bd_pins axi_dma/m_axi_s2mm_aclk] [get_bd_pins axis_subset_converter_im/aclk] \
  [get_bd_pins fm_demod_rate_change/clk] [get_bd_pins audio_rate_change/clk] [get_bd_pins fm_demodulation/IPCORE_CLK] \
  [get_bd_pins fm_demodulation/AXI4_Lite_ACLK] [get_bd_pins axis_subset_converter_re/aclk]
connect_bd_net -net proc_sys_reset_peripheral_aresetn [get_bd_pins s_axis_aresetn] \
  [get_bd_pins axi_dma/axi_resetn] [get_bd_pins axis_subset_converter_im/aresetn] [get_bd_pins fm_demod_rate_change/aresetn] \
  [get_bd_pins audio_rate_change/aresetn] [get_bd_pins fm_demodulation/IPCORE_RESETN] \
  [get_bd_pins fm_demodulation/AXI4_Lite_ARESETN] [get_bd_pins axis_subset_converter_re/aresetn]

current_bd_instance /radio/transmitter
connect_bd_intf_net [get_bd_intf_pins m10_axis] [get_bd_intf_pins channel_10/m_axis]
connect_bd_intf_net [get_bd_intf_pins m00_axis] [get_bd_intf_pins channel_00/m_axis]
connect_bd_intf_net [get_bd_intf_pins axi_interconnect_ps/M01_AXI] [get_bd_intf_pins channel_10/S_AXI]
connect_bd_intf_net [get_bd_intf_pins S_AXI] [get_bd_intf_pins axi_interconnect_ps/S00_AXI]
connect_bd_intf_net [get_bd_intf_pins axi_interconnect_ps/M00_AXI] [get_bd_intf_pins channel_00/S_AXI]
connect_bd_net -net ACLK_1 [get_bd_pins s_axi_aclk] [get_bd_pins axi_interconnect_ps/ACLK] [get_bd_pins axi_interconnect_ps/S00_ACLK]
connect_bd_net -net ARESETN_1 [get_bd_pins s_axi_aresetn] [get_bd_pins axi_interconnect_ps/ARESETN] [get_bd_pins axi_interconnect_ps/S00_ARESETN]
connect_bd_net -net M00_ACLK_1 [get_bd_pins m00_axis_aclk] [get_bd_pins axi_interconnect_ps/M00_ACLK] [get_bd_pins channel_00/s_axi_aclk]
connect_bd_net -net M00_ARESETN_1 [get_bd_pins m00_axis_aresetn] [get_bd_pins axi_interconnect_ps/M00_ARESETN] [get_bd_pins channel_00/s_axi_aresetn]
connect_bd_net -net rst_usp_rf_data_converter_256M_peripheral_aresetn [get_bd_pins m10_axis_aresetn] \
  [get_bd_pins axi_interconnect_ps/M01_ARESETN] [get_bd_pins channel_10/s_axi_aresetn]
connect_bd_net -net usp_rf_data_converter_clk_dac1 [get_bd_pins m10_axis_aclk] \
  [get_bd_pins axi_interconnect_ps/M01_ACLK] [get_bd_pins channel_10/s_axi_aclk]

current_bd_instance /radio/transmitter/channel_00
connect_bd_intf_net [get_bd_intf_pins axis_broadcaster/M00_AXIS] [get_bd_intf_pins axis_combiner/S00_AXIS]
connect_bd_intf_net [get_bd_intf_pins S_AXI] [get_bd_intf_pins control/AXI4_Lite]
connect_bd_intf_net [get_bd_intf_pins axis_broadcaster/S_AXIS] [get_bd_intf_pins control/AXI4_Stream_Master]
connect_bd_intf_net [get_bd_intf_pins m_axis] [get_bd_intf_pins axis_combiner/M_AXIS]
connect_bd_intf_net [get_bd_intf_pins axis_broadcaster/M01_AXIS] [get_bd_intf_pins axis_combiner/S01_AXIS]
connect_bd_net -net rst_usp_rf_data_converter_256M_peripheral_aresetn [get_bd_pins s_axi_aresetn] \
  [get_bd_pins axis_broadcaster/aresetn] [get_bd_pins axis_combiner/aresetn] [get_bd_pins control/AXI4_Lite_ARESETN] \
  [get_bd_pins control/IPCORE_RESETN]
connect_bd_net -net usp_rf_data_converter_clk_dac1 [get_bd_pins s_axi_aclk] \
  [get_bd_pins axis_broadcaster/aclk] [get_bd_pins axis_combiner/aclk] [get_bd_pins control/AXI4_Lite_ACLK] \
  [get_bd_pins control/IPCORE_CLK]

current_bd_instance /radio/transmitter/channel_10
connect_bd_intf_net [get_bd_intf_pins axis_broadcaster/M01_AXIS] [get_bd_intf_pins axis_combiner/S01_AXIS]
connect_bd_intf_net [get_bd_intf_pins axis_broadcaster/S_AXIS] [get_bd_intf_pins control/AXI4_Stream_Master]
connect_bd_intf_net [get_bd_intf_pins m_axis] [get_bd_intf_pins axis_combiner/M_AXIS]
connect_bd_intf_net [get_bd_intf_pins S_AXI] [get_bd_intf_pins control/AXI4_Lite]
connect_bd_intf_net [get_bd_intf_pins axis_broadcaster/M00_AXIS] [get_bd_intf_pins axis_combiner/S00_AXIS]
connect_bd_net -net rst_usp_rf_data_converter_256M_peripheral_aresetn [get_bd_pins s_axi_aresetn] \
  [get_bd_pins axis_broadcaster/aresetn] [get_bd_pins axis_combiner/aresetn] [get_bd_pins control/AXI4_Lite_ARESETN] \
  [get_bd_pins control/IPCORE_RESETN]
connect_bd_net -net usp_rf_data_converter_clk_dac1 [get_bd_pins s_axi_aclk] \
  [get_bd_pins axis_broadcaster/aclk] [get_bd_pins axis_combiner/aclk] [get_bd_pins control/AXI4_Lite_ACLK] \
  [get_bd_pins control/IPCORE_CLK]

current_bd_instance /
connect_bd_intf_net [get_bd_intf_ports sysref_in] [get_bd_intf_pins radio/sysref_in]
connect_bd_intf_net [get_bd_intf_ports vout00] [get_bd_intf_pins radio/vout00]
connect_bd_intf_net [get_bd_intf_ports dac0_clk] [get_bd_intf_pins radio/dac0_clk]
connect_bd_intf_net [get_bd_intf_ports adc2_clk] [get_bd_intf_pins radio/adc2_clk]
connect_bd_intf_net [get_bd_intf_ports vout10] [get_bd_intf_pins radio/vout10]
connect_bd_intf_net [get_bd_intf_pins axi_smc/S01_AXI] [get_bd_intf_pins radio/M_AXI_S2MM]
connect_bd_intf_net [get_bd_intf_ports dac1_clk] [get_bd_intf_pins radio/dac1_clk]
connect_bd_intf_net [get_bd_intf_pins radio/S_AXI] [get_bd_intf_pins zynq_ultra_ps_e/M_AXI_HPM0_LPD]
connect_bd_intf_net [get_bd_intf_ports vin0_01] [get_bd_intf_pins radio/vin0_01]
connect_bd_intf_net [get_bd_intf_ports vin2_01] [get_bd_intf_pins radio/vin2_01]
connect_bd_intf_net [get_bd_intf_pins axi_smc/M00_AXI] [get_bd_intf_pins zynq_ultra_ps_e/S_AXI_HP2_FPD]
connect_bd_intf_net [get_bd_intf_ports adc0_clk] [get_bd_intf_pins radio/adc0_clk]
connect_bd_intf_net [get_bd_intf_pins axi_smc/S00_AXI] [get_bd_intf_pins radio/M_AXI]
connect_bd_net [get_bd_pins clk_wiz_260M/clk_out1] \
  [get_bd_pins axi_smc/aclk] [get_bd_pins radio/m_axi_aclk] [get_bd_pins rst_ps8_260M/slowest_sync_clk] \
  [get_bd_pins zynq_ultra_ps_e/saxihp2_fpd_aclk]
connect_bd_net [get_bd_pins clk_wiz_260M/locked] [get_bd_pins rst_ps8_260M/dcm_locked]
connect_bd_net [get_bd_pins lmk_reset_low/dout] [get_bd_ports lmk_reset]
connect_bd_net [get_bd_pins rst_ps8_260M/peripheral_aresetn] [get_bd_pins axi_smc/aresetn] [get_bd_pins radio/m_axi_aresetn]
connect_bd_net [get_bd_pins rst_ps8_300M/peripheral_aresetn] [get_bd_pins clk_wiz_260M/resetn]
connect_bd_net -net rst_ps8_96M_peripheral_aresetn [get_bd_pins rst_ps8_100M/peripheral_aresetn] [get_bd_pins radio/s_axi_aresetn]
connect_bd_net [get_bd_pins zynq_ultra_ps_e/pl_clk0] \
  [get_bd_pins radio/s_axi_aclk] [get_bd_pins rst_ps8_100M/slowest_sync_clk] [get_bd_pins zynq_ultra_ps_e/maxihpm0_lpd_aclk]
connect_bd_net [get_bd_pins zynq_ultra_ps_e/pl_clk1] [get_bd_pins clk_wiz_260M/clk_in1] [get_bd_pins rst_ps8_300M/slowest_sync_clk]
connect_bd_net [get_bd_pins zynq_ultra_ps_e/pl_resetn0] \
  [get_bd_pins radio/ext_reset] [get_bd_pins rst_ps8_100M/ext_reset_in] [get_bd_pins rst_ps8_260M/ext_reset_in] \
  [get_bd_pins rst_ps8_300M/ext_reset_in]

# ---- address map ----
assign_bd_address -offset 0x0000000000000000 -range 2G -target_address_space [get_bd_addr_spaces radio/receiver/channel_00/fm_audio/axi_dma/Data_S2MM] [get_bd_addr_segs zynq_ultra_ps_e/SAXIGP4/HP2_DDR_LOW]
exclude_bd_addr_seg -offset 0x00000000FF000000 -range 16M -target_address_space [get_bd_addr_spaces radio/receiver/channel_00/fm_audio/axi_dma/Data_S2MM] [get_bd_addr_segs zynq_ultra_ps_e/SAXIGP4/HP2_LPS_OCM]
assign_bd_address -offset 0x00000000 -range 2G -target_address_space [get_bd_addr_spaces radio/receiver/channel_00/spectrum_analyser/AXI4_Master] [get_bd_addr_segs zynq_ultra_ps_e/SAXIGP4/HP2_DDR_LOW]
assign_bd_address -offset 0xFF000000 -range 16M -target_address_space [get_bd_addr_spaces radio/receiver/channel_00/spectrum_analyser/AXI4_Master] [get_bd_addr_segs zynq_ultra_ps_e/SAXIGP4/HP2_LPS_OCM]
assign_bd_address -offset 0x0080000000 -range 256K -target_address_space [get_bd_addr_spaces zynq_ultra_ps_e/Data] [get_bd_addr_segs radio/rfdc/s_axi/Reg]
assign_bd_address -offset 0x0080040000 -range 64K -target_address_space [get_bd_addr_spaces zynq_ultra_ps_e/Data] [get_bd_addr_segs radio/receiver/channel_00/fm_audio/fm_demodulation/AXI4_Lite/reg0]
assign_bd_address -offset 0x0080050000 -range 64K -target_address_space [get_bd_addr_spaces zynq_ultra_ps_e/Data] [get_bd_addr_segs radio/receiver/channel_00/decimator/xsg_bwselector_s_axi/reg0]
assign_bd_address -offset 0x0080060000 -range 64K -target_address_space [get_bd_addr_spaces zynq_ultra_ps_e/Data] [get_bd_addr_segs radio/receiver/channel_00/spectrum_analyser/AXI4_Lite/reg0]
assign_bd_address -offset 0x0080070000 -range 64K -target_address_space [get_bd_addr_spaces zynq_ultra_ps_e/Data] [get_bd_addr_segs radio/receiver/channel_00/fm_audio/axi_dma/S_AXI_LITE/Reg]
assign_bd_address -offset 0x0080080000 -range 64K -target_address_space [get_bd_addr_spaces zynq_ultra_ps_e/Data] [get_bd_addr_segs radio/transmitter/channel_10/control/AXI4_Lite/reg0]
assign_bd_address -offset 0x0080090000 -range 64K -target_address_space [get_bd_addr_spaces zynq_ultra_ps_e/Data] [get_bd_addr_segs radio/transmitter/channel_00/control/AXI4_Lite/reg0]

validate_bd_design
save_bd_design
